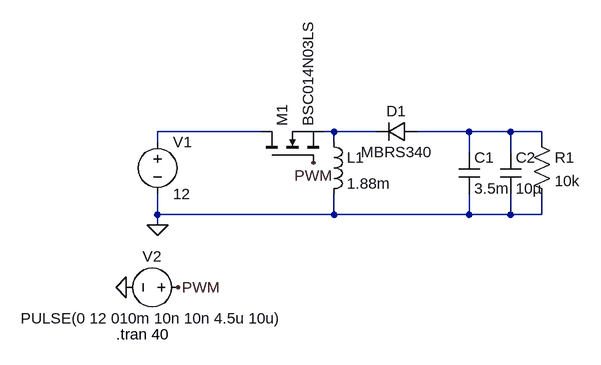
[diagram p0: schematic BUCK BOOST.asc]
BUCK BOOST.asc, the LTspice schematic file:
Version 4.1
SHEET 1 880 680
WIRE 160 96 0 96
WIRE 272 96 256 96
WIRE 336 96 272 96
WIRE 480 96 400 96
WIRE 544 96 480 96
WIRE 592 96 544 96
WIRE 0 112 0 96
WIRE 272 112 272 96
WIRE 592 112 592 96
WIRE 480 128 480 96
WIRE 544 128 544 96
WIRE 0 224 0 192
WIRE 272 224 272 192
WIRE 272 224 0 224
WIRE 480 224 480 192
WIRE 480 224 272 224
WIRE 544 224 544 192
WIRE 544 224 480 224
WIRE 592 224 592 192
WIRE 592 224 544 224
WIRE 0 240 0 224
FLAG -48 336 0
FLAG 0 240 0
FLAG 32 336 PWM
FLAG 240 144 PWM
SYMBOL voltage 0 96 R0
WINDOW 123 0 0 Left 0
WINDOW 39 0 0 Left 0
SYMATTR InstName V1
SYMATTR Value 12
SYMBOL cap 464 128 R0
SYMATTR InstName C1
SYMATTR Value 3.5m
SYMATTR SpiceLine Rser=10m
SYMBOL voltage 48 336 R90
WINDOW 0 -32 56 VBottom 2
WINDOW 3 32 56 VTop 2
WINDOW 123 0 0 Left 0
WINDOW 39 0 0 Left 0
SYMATTR InstName V2
SYMATTR Value PULSE(0 12 010m 10n 10n 4.5u 10u)
SYMBOL diode 400 80 R90
WINDOW 0 0 32 VBottom 2
WINDOW 3 32 32 VTop 2
SYMATTR InstName D1
SYMATTR Value MBRS340
SYMBOL nmos 160 144 R270
SYMATTR InstName M1
SYMATTR Value BSC014N03LS
SYMBOL res 576 96 R0
SYMATTR InstName R1
SYMATTR Value 10k
SYMBOL ind 256 96 R0
SYMATTR InstName L1
SYMATTR Value 1.88m
SYMBOL cap 528 128 R0
SYMATTR InstName C2
SYMATTR Value 10µ
TEXT -64 408 Left 2 !.tran 40

The netlist it stands for:
* BUCK BOOST.asc
V1 N001 0 12
C1 N003 0 3.5m Rser=10m
V2 PWM 0 PULSE(0 12 010m 10n 10n 4.5u 10u)
D1 N003 N002 MBRS340
M1 N001 PWM N002 N002 BSC014N03LS
R1 N003 0 10k
L1 N002 0 1.88m
C2 N003 0 10µ
.model D D
.lib standard.dio
.model NMOS NMOS
.model PMOS PMOS
.lib standard.mos
.tran 40
.backanno
.end